# EasyEDA Pro project 磁回弹自动pcb电键_2024-09-19.epro

# Schematic 简易磁回弹自动电键
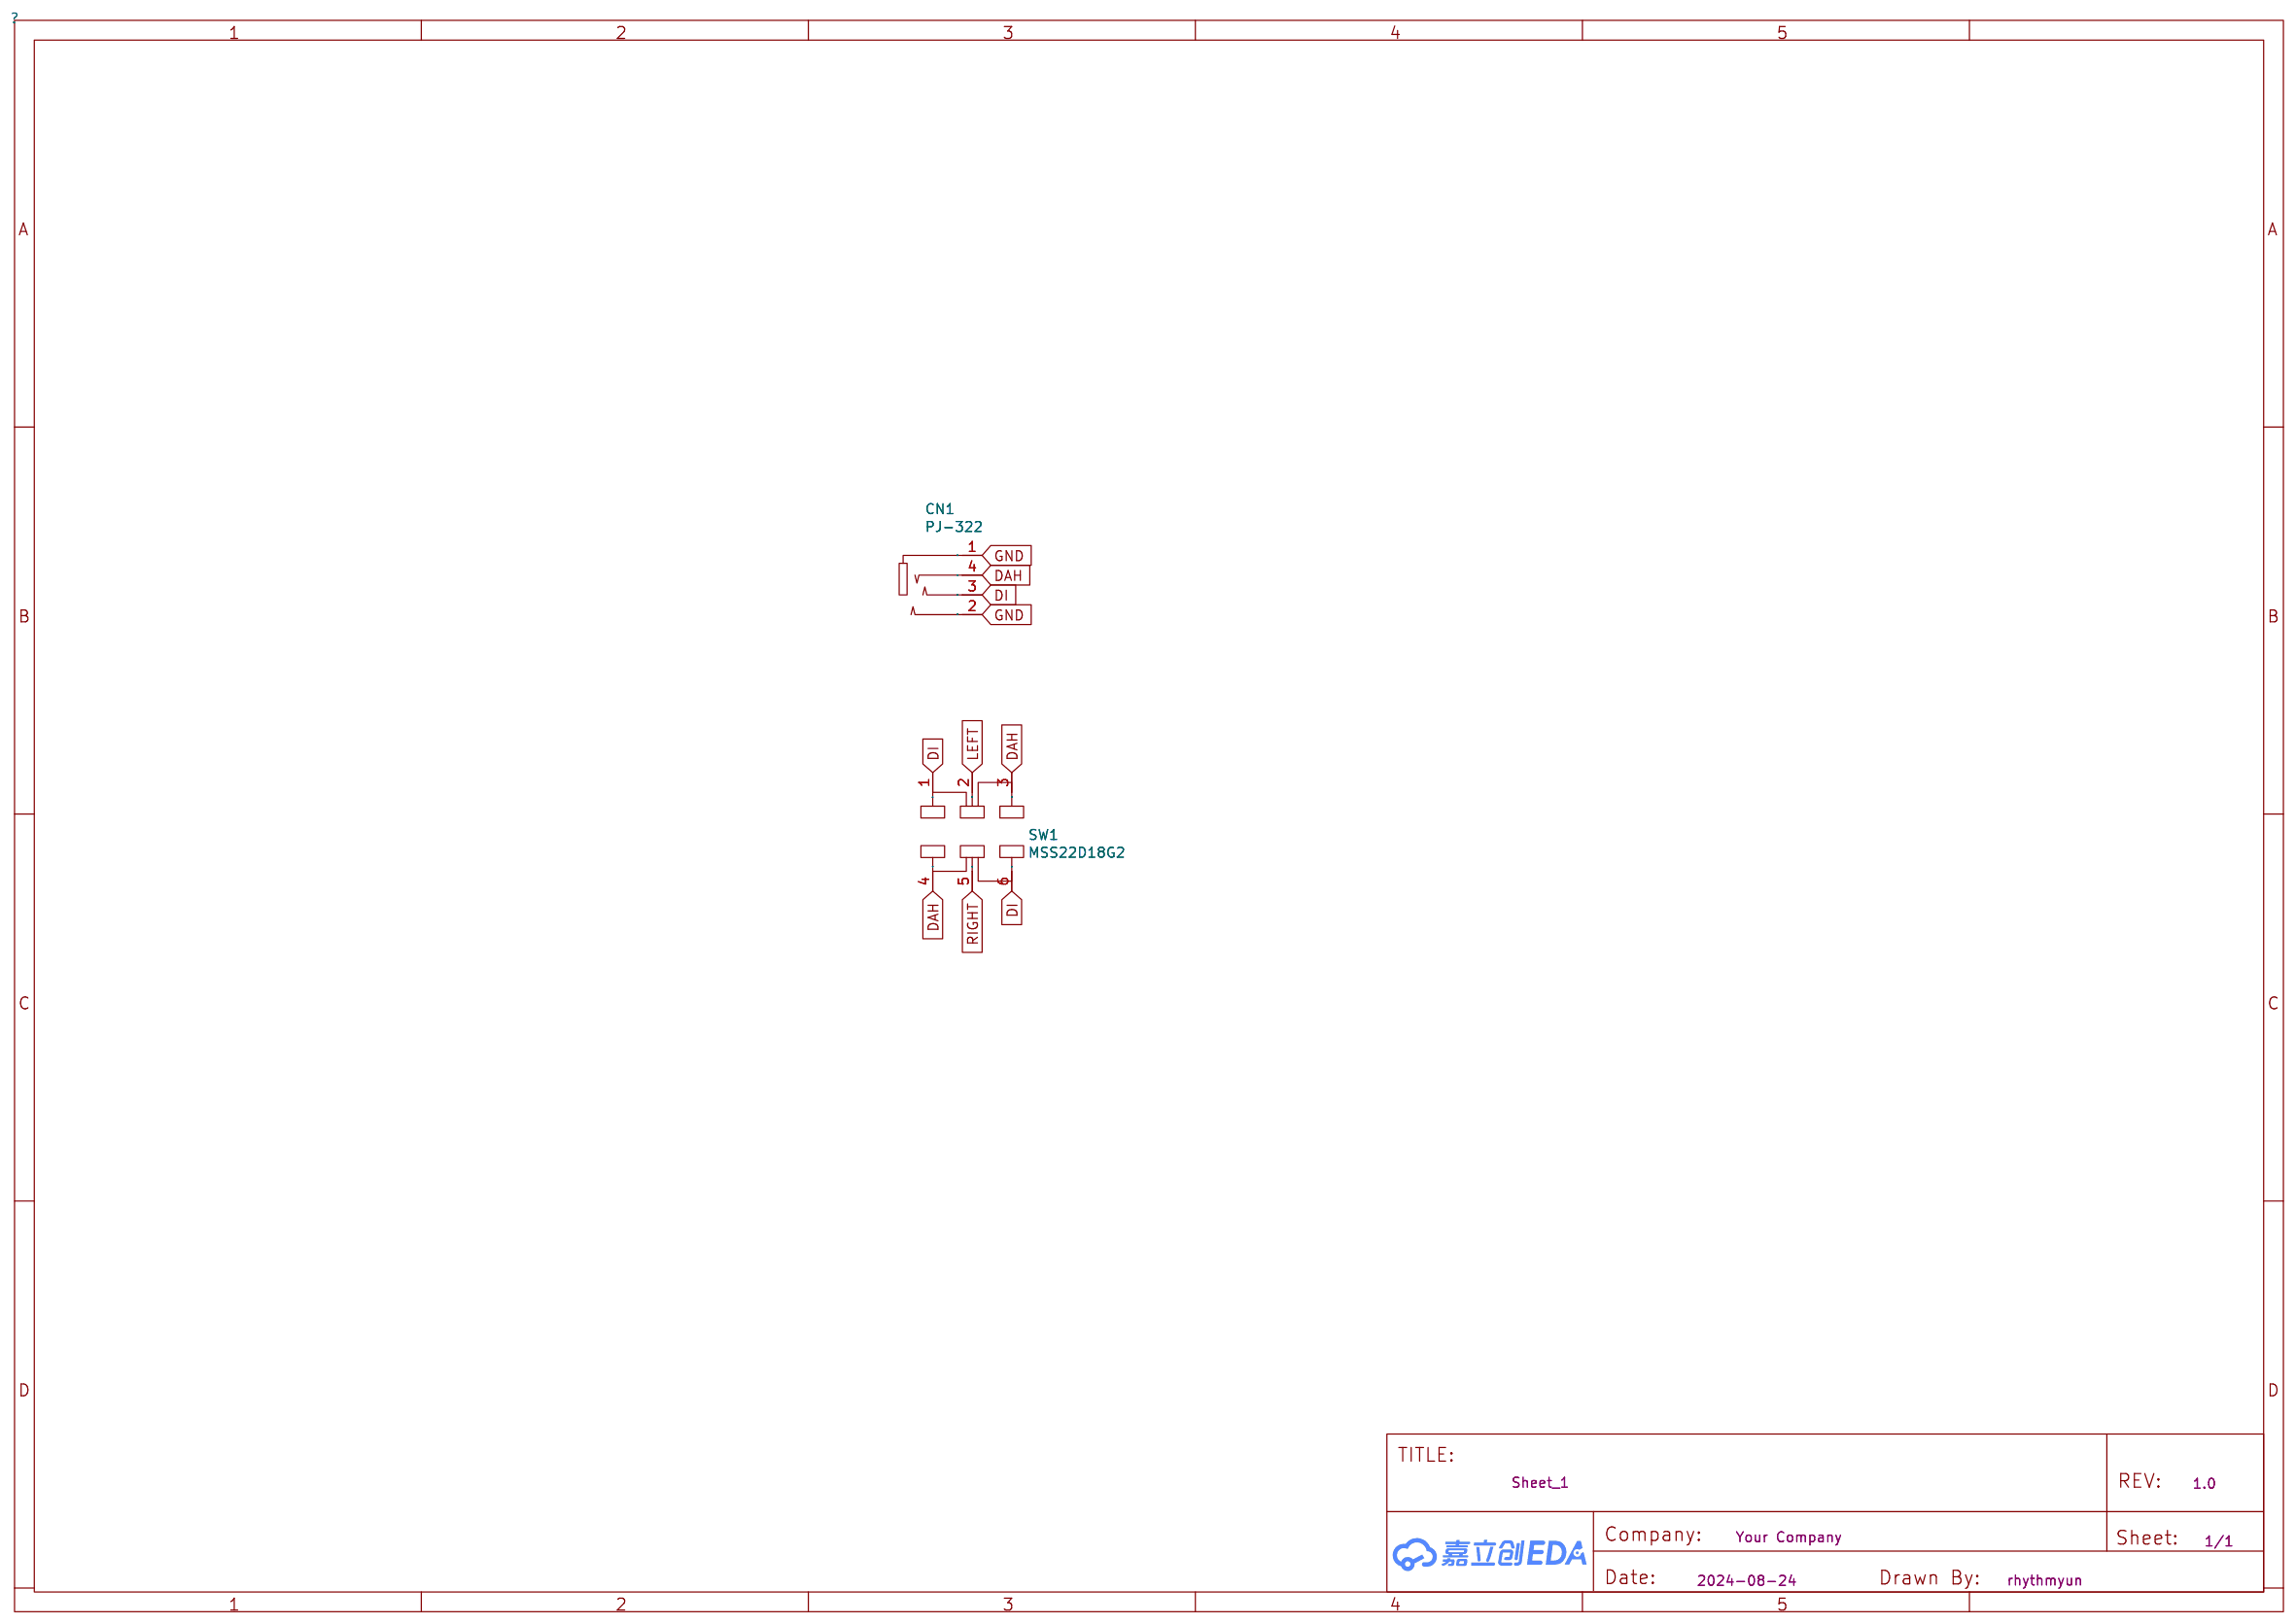
[diagram p0: schematic sheet]

## Parts
CN1  PJ-322  [AUDIO-TH_HOOYA_PJ-322]
SW1  MSS22D18G2  [SW-TH_MSS22D18GX]

## Library data of the parts
CN1 = PJ-322: Supplier: LCSC; Supplier Part: C2939185; Manufacturer: HOOYA(皓宇电子); Manufacturer Part: PJ-322环保; JLCPCB Part Class: Extended Part
SW1 = MSS22D18G2: Supplier: LCSC; Supplier Part: C431542; Manufacturer: SHOU HAN(首韩); JLCPCB Part Class: Extended Part

## Nets
GND: CN1.1 CN1.2
DAH: CN1.4 SW1.3 SW1.4
DI: CN1.3 SW1.1 SW1.6
LEFT: SW1.2
RIGHT: SW1.5

# Board 主面板
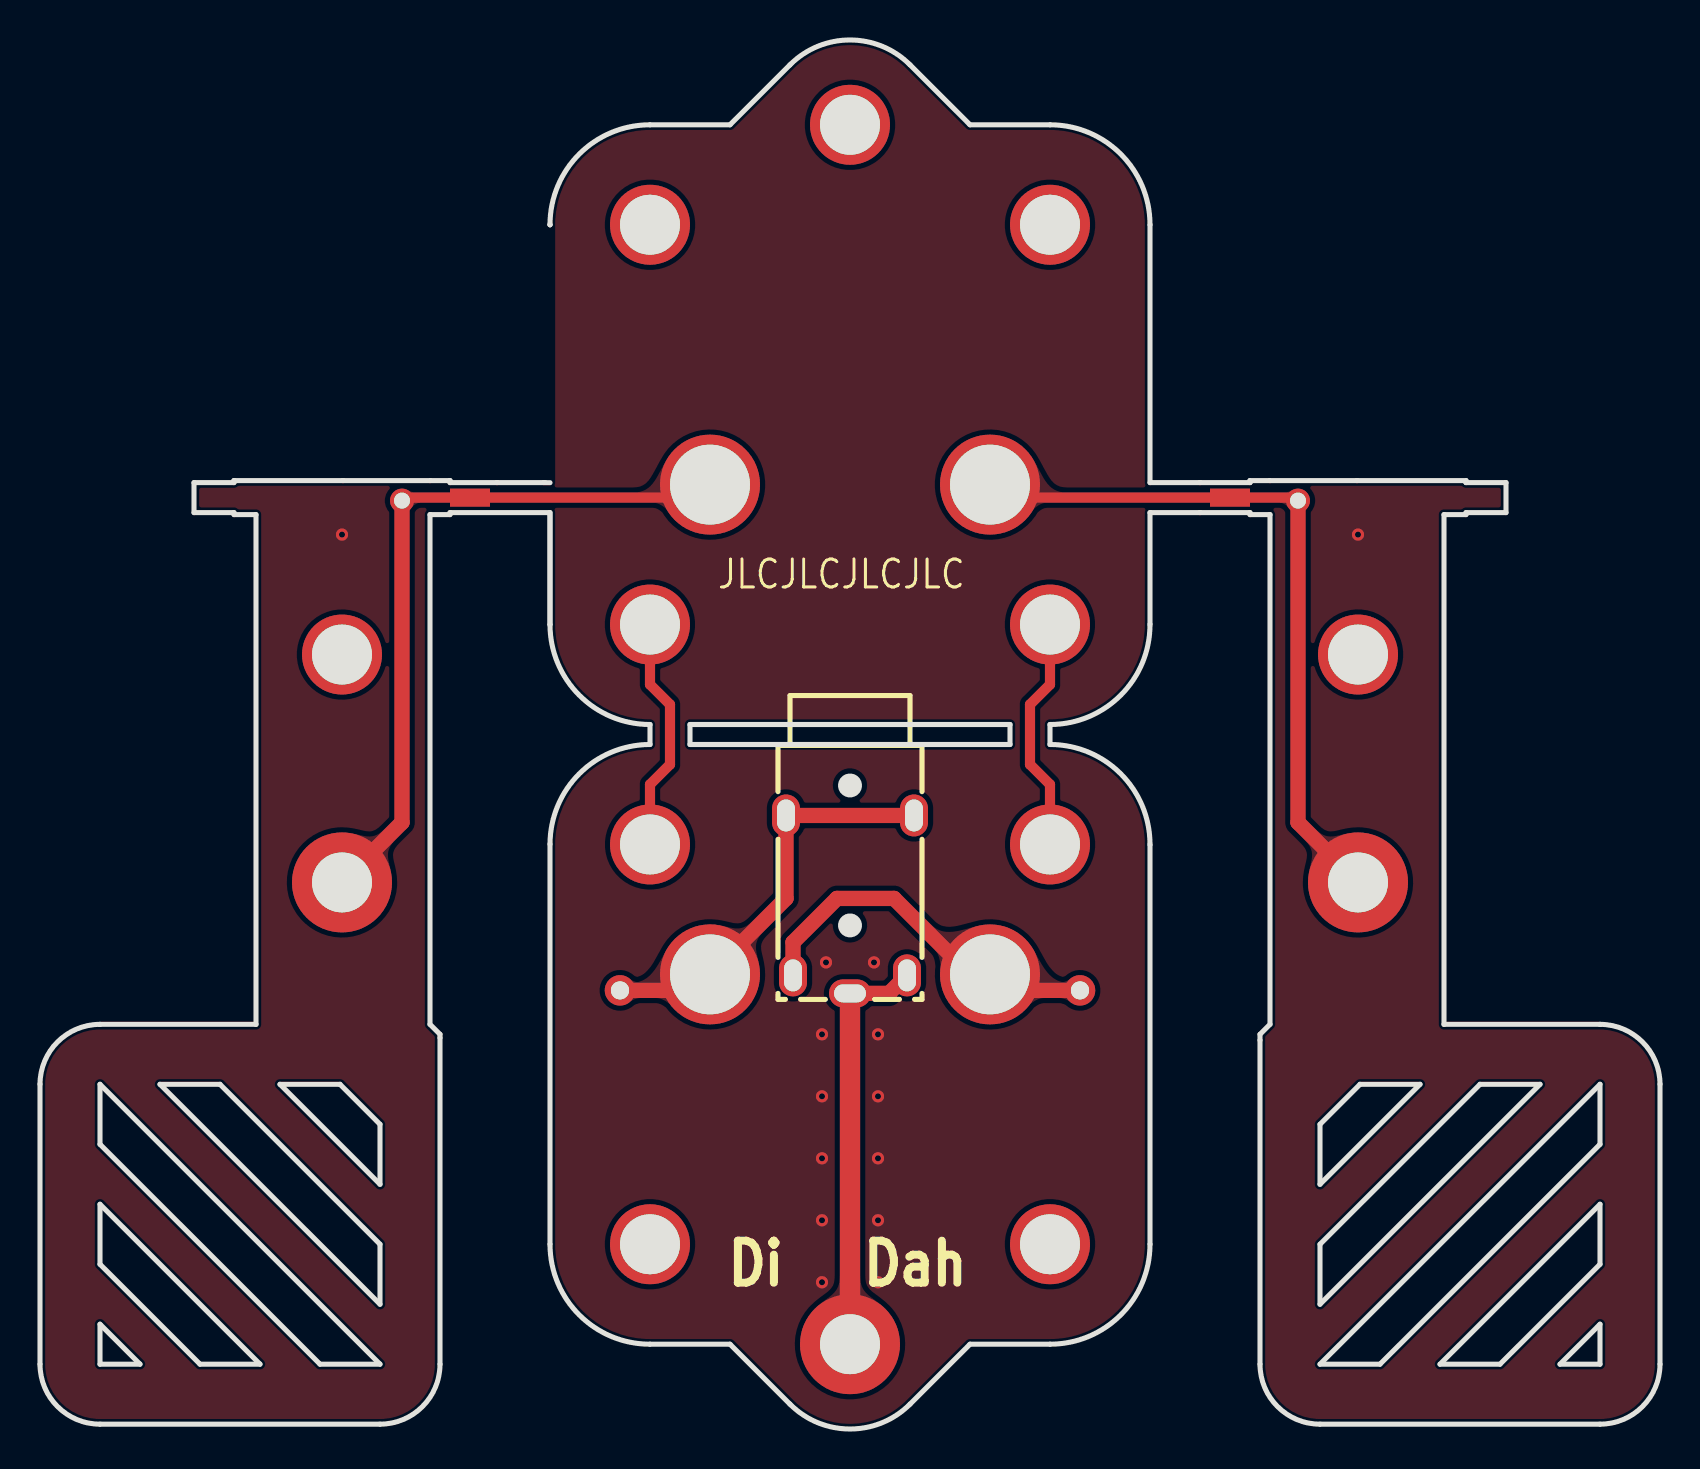
[diagram p1: board, top side]
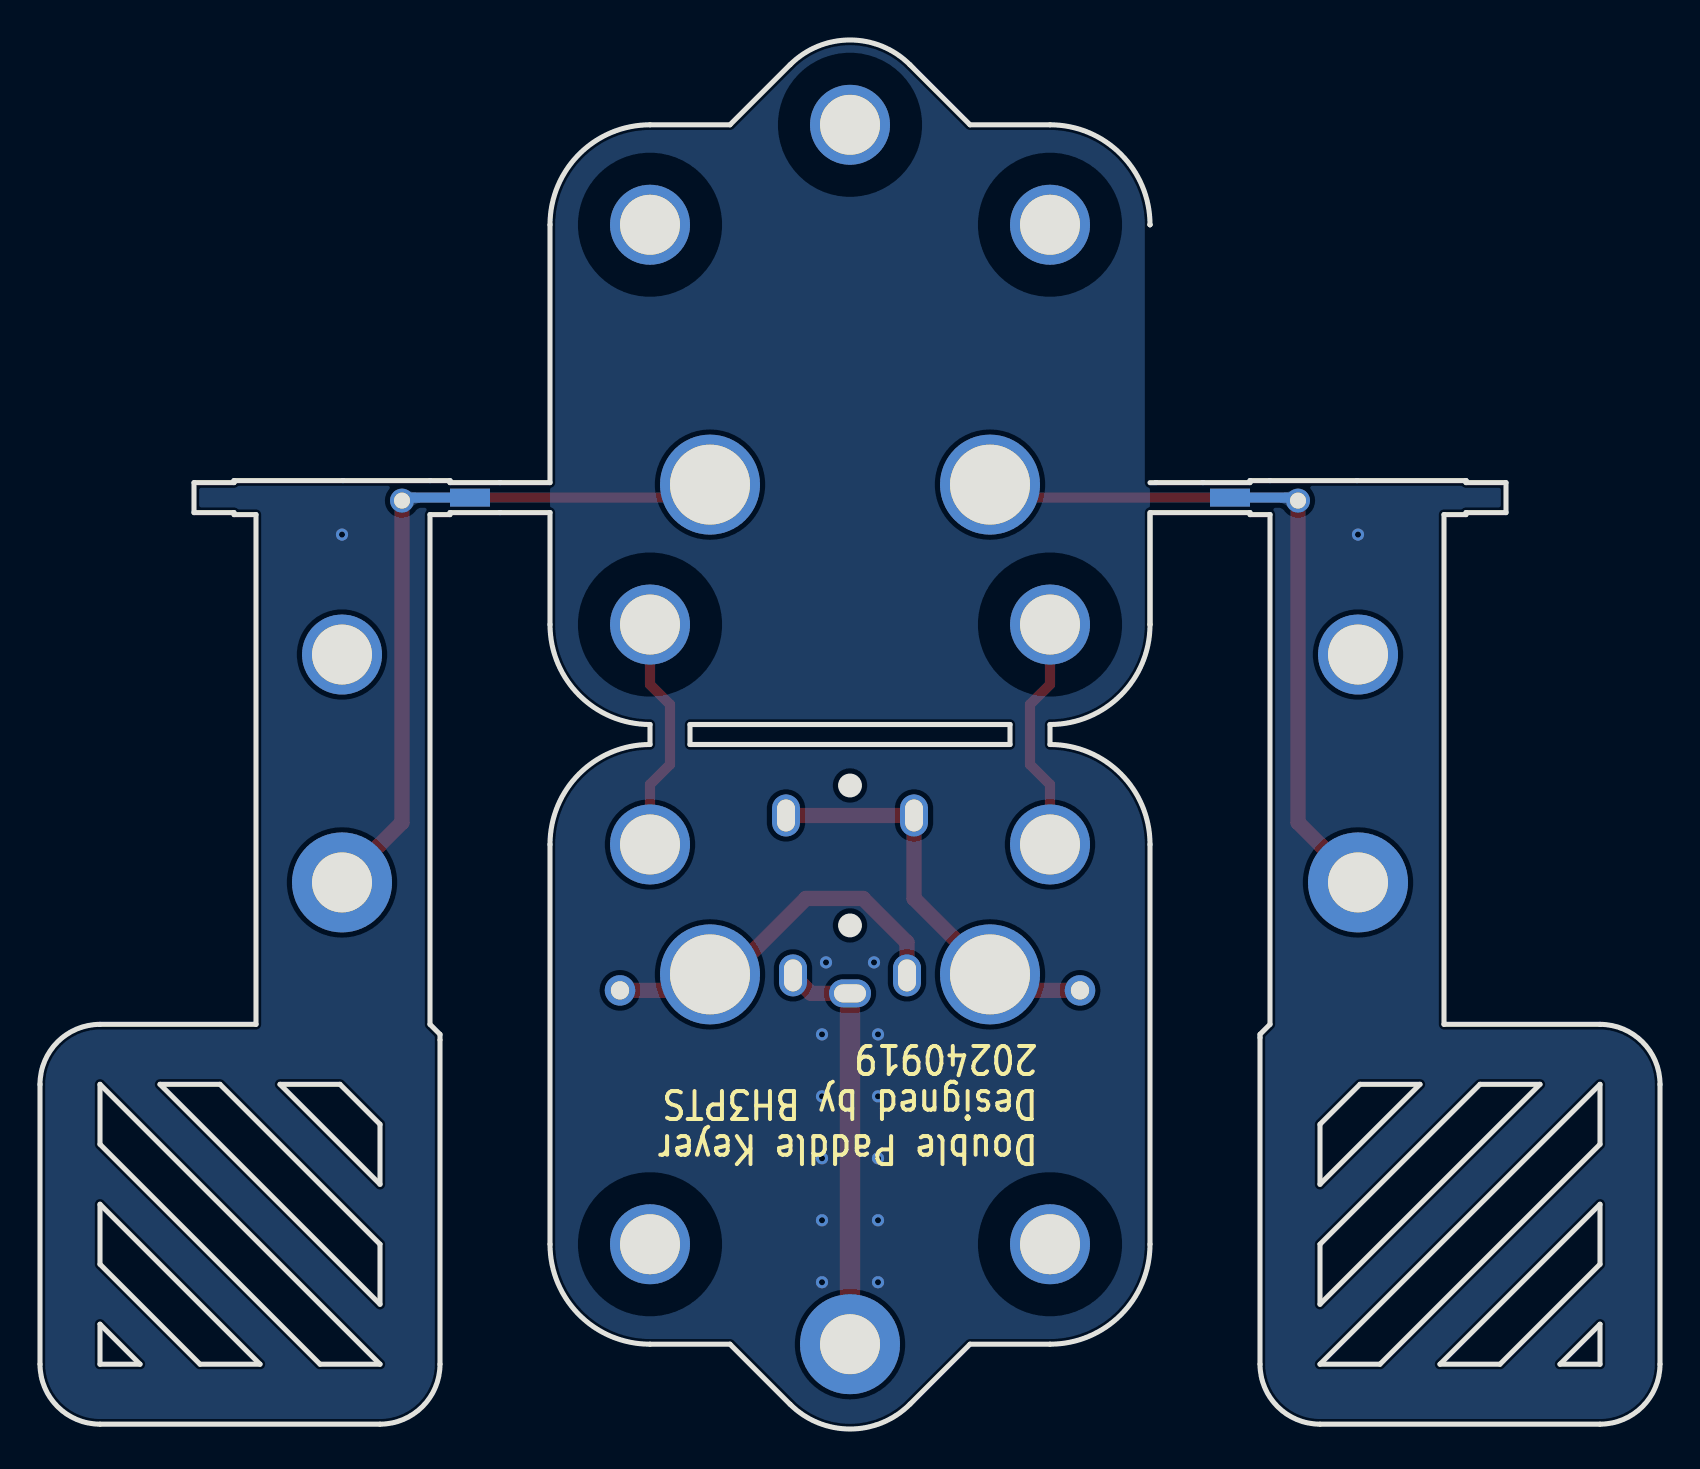
[diagram p2: board, bottom side, seen from below]

Outline 81 x 69.49 mm; copper layers: Top Layer, Bottom Layer. Coordinates in mm from the lower left corner of the outline.
Outline path: 25.5,45.84 20.5,45.84 20.5,45.74 19.5,45.74 19.5,20.24 20,19.74 20,3.24 arc(19.12,1.12) 17,0.24 3,0.24 arc(0.88,1.12) 0,3.24 0,17.24 arc(0.88,19.36) 3,20.24 10.8,20.24 10.8,45.74 9.7,45.74 9.7,45.84 7.7,45.84 7.7,47.34 9.7,47.34 9.7,47.44 9.7,47.44 20.5,47.44 20.5,47.44 20.5,47.34 25.2,47.34 25.5,47.34 ; 25.5,60.24 25.5,60.24 25.5,60.24 ; 25.5,60.24 arc(26.96,63.78) 30.5,65.24 34.5,65.24 37.5,68.24 arc(40.5,69.49) 43.5,68.24 46.5,65.24 50.5,65.24 arc(54.04,63.78) 55.5,60.24 55.5,47.34 60.5,47.34 60.5,47.35 60.5,47.44 71.3,47.44 71.3,47.35 71.3,47.34 73.3,47.34 73.3,45.84 71.3,45.84 71.3,45.74 70.2,45.74 70.2,20.24 78,20.24 arc(80.12,19.36) 81,17.24 81,3.24 arc(80.12,1.12) 78,0.24 64,0.24 arc(61.88,1.12) 61,3.24 61,19.74 61.5,20.24 61.5,45.74 60.5,45.74 60.5,45.84 55.5,45.84 55.5,40.25 arc(54.04,36.71) 50.5,35.24 50.5,34.24 arc(54.04,32.78) 55.5,29.24 55.5,9.24 arc(54.04,5.71) 50.5,4.24 46.5,4.24 43.5,1.24 arc(40.5,0) 37.5,1.24 34.5,4.24 30.5,4.24 arc(26.96,5.71) 25.5,9.24 25.5,29.24 arc(26.96,32.78) 30.5,34.24 30.5,35.24 arc(26.96,36.71) 25.5,40.24 ; 25.5,40.24 25.5,45.84 ; 25.5,40.24 25.5,45.74 ; 3,17.24 3,14.24 14,3.24 17,3.24 3,17.24 ; 3,11.24 3,8.24 8,3.24 11,3.24 3,11.24 ; 3,5.24 3,3.24 5,3.24 3,5.24 ; 6,17.24 9,17.24 17,9.24 17,6.24 6,17.24 ; 12,17.24 15,17.24 17,15.24 17,12.24 12,17.24 ; 32.5,35.24 48.5,35.24 48.5,34.24 32.5,34.24 32.5,35.24 ; 64,15.24 64,12.24 69,17.24 66,17.24 64,15.24 ; 64,9.24 64,6.24 75,17.24 72,17.24 64,9.24 ; 64,3.24 78,17.24 78,14.24 67,3.24 64,3.24 ; 70,3.24 78,11.24 78,8.24 73,3.24 70,3.24 ; 76,3.24 78,5.24 78,3.24 76,3.24
Stack: Top Layer 0.035mm / Dielectric1 1.51mm FR4 er 4.5 / Bottom Layer 0.035mm

## Design rules (mm)
template: JLCPCB Capability(Two Layers Board)
spacing copperThickness1oz (default): track to track 0.102, other pairs 0.152 to 0.3
spacing copperThickness2oz: track to track 0.203, other pairs 0.152 to 0.3
track width copperThickness1oz (default): min 0.127, default 0.254, max 2.54
track width copperThickness2oz: min 0.203, default 0.254, max 2.54
differential pair differentialPair (default): width min 0.127, default 0.254, max 2.54; gap min 0.152, default 0.152
via viaSize (default): diameter min 0.5, default 0.61, max 10; hole min 0.3, default 0.305, max 6.3

## Placement (name value [footprint] x y rotation side)
CN1  PJ-322  [AUDIO-TH_HOOYA_PJ-322]  40.5 26.24 270 top
NOREF  -  [Pad_e187]  65.9 27.34 0 top
NOREF#2  -  [Pad_e76]  62.9 46.44 180 top
NOREF#3  -  [Pad_e37]  30.5 9.24 0 top
NOREF#4  -  [Pad_e80]  33.5 47.24 180 top
NOREF#5  -  [Pad_e35]  50.5 29.24 0 top
NOREF#6  -  [Pad_e39]  33.5 22.74 0 top
NOREF#7  -  [Pad_e81]  47.5 47.24 180 top
NOREF#8  -  [Pad_e72]  59.5 46.59 0 top
NOREF#9  -  [Pad_e40]  47.5 22.74 0 top
NOREF#10  -  [Pad_e85]  30.5 40.24 180 top
NOREF#11  -  [Pad_e305]  21.5 46.59 180 top
NOREF#12  -  [Pad_e797]  52 21.94 180 top
NOREF#13  -  [Pad_e75]  59.5 46.59 0 top
NOREF#14  -  [Pad_e186]  65.9 38.74 0 top
NOREF#15  -  [Pad_e82]  50.5 60.24 180 top
NOREF#16  -  [Pad_e304]  21.5 46.59 180 top
NOREF#17  -  [Pad_e33]  30.5 29.24 0 top
NOREF#18  -  [Pad_e302]  18.1 46.44 0 top
NOREF#19  -  [Pad_e301]  15.1 27.34 180 top
NOREF#20  -  [Pad_e303]  15.1 38.74 180 top
NOREF#21  -  [Pad_e83]  40.5 65.24 180 top
NOREF#22  -  [Pad_e36]  50.5 9.24 0 top
NOREF#23  -  [Pad_e84]  50.5 40.24 180 top
NOREF#24  -  [Pad_e796]  29 21.94 0 top
NOREF#25  -  [Pad_e38]  40.5 4.24 0 top
NOREF#26  -  [Pad_e79]  30.5 60.24 180 top

## Footprints (pads in the part's own frame, mm; a bottom-side part is the same pattern mirrored in y, then rotated)
AUDIO-TH_HOOYA_PJ-322
  oval 1.4x2.1 hole 0.9x1.6: 1(4.45,0)
  oval 2.1x1.4 hole 1.6x0.9: 2(3.55,2.85) 3(-4.45,3.2) 3(-4.45,-3.2) 4(3.55,-2.85)
Pad_e33
  round 4 hole 3: (0,0)
Pad_e35
  round 4 hole 3: (0,0)
Pad_e36
  round 4 hole 3: (0,0)
Pad_e37
  round 4 hole 3: (0,0)
Pad_e38
  round 5 hole 3: (0,0)
Pad_e39
  round 5 hole 4: (0,0)
Pad_e40
  round 5 hole 4: (0,0)
Pad_e72
  custom 0x0 smd: 1(0,0)
Pad_e75
  custom 0x0 smd far side: 1(0,0)
Pad_e76
  round 1.2 hole 0.8: 1(0,0)
Pad_e79
  round 4 hole 3: (0,0)
Pad_e80
  round 5 hole 4: 1(0,0)
Pad_e81
  round 5 hole 4: 2(0,0)
Pad_e82
  round 4 hole 3: (0,0)
Pad_e83
  round 4 hole 3: (0,0)
Pad_e84
  round 4 hole 3: (0,0)
Pad_e85
  round 4 hole 3: (0,0)
Pad_e186
  round 4 hole 3: (0,0)
Pad_e187
  round 5 hole 3: (0,0)
Pad_e301
  round 5 hole 3: (0,0)
Pad_e302
  round 1.2 hole 0.8: 1(0,0)
Pad_e303
  round 4 hole 3: (0,0)
Pad_e304
  custom 0x0 smd: 1(0,0)
Pad_e305
  custom 0x0 smd far side: 1(0,0)
Pad_e796
  round 1.524 hole 0.914: 1(0,0)
Pad_e797
  round 1.524 hole 0.914: 1(0,0)

## Nets
DGND: CN1.1 CN1.2 NOREF#21. NOREF#25.
DAH: CN1.4 NOREF. NOREF#2.1 NOREF#7.2 NOREF#8.1 NOREF#9. NOREF#12.1 NOREF#13.1
DI: CN1.3 NOREF#4.1 NOREF#6. NOREF#11.1 NOREF#16.1 NOREF#18.1 NOREF#19. NOREF#24.1

## Via types
v1: diameter 0.61, hole 0.305, Top Layer to Bottom Layer, 14 vias

## Routing (per net, layer and track width the routed paths; a pad name or vN(x,y) marks a point on that pad's centre or on a via; arc(x,y) is an arc through that point)
DGND: length 20.8
  Top Layer w0.762: CN1.2 42.45,21.79 CN1.1
  Top Layer w1.016: 40.5,4.24 CN1.1
GND:
  vias: v1(15.1,44.74) v1(39.1,19.74) v1(39.1,16.64) v1(39.1,13.54) v1(39.1,10.44) v1(39.1,7.34) v1(39.3,23.34) v1(41.7,23.34) v1(41.9,19.74) v1(41.9,16.64) v1(41.9,13.54) v1(41.9,10.44) v1(41.9,7.34) v1(65.9,44.74)
(no net): length 23.7
  Top Layer w0.508: 30.5,29.24 30.5,32.24 31.5,33.24 31.5,36.24 30.5,37.24 30.5,40.24 ; 50.5,29.24 50.5,32.24 49.5,33.24 49.5,36.24 50.5,37.24 50.5,40.24
DAH: length 59.1
  Top Layer w0.508: NOREF#7.2 48.15,46.59 62.75,46.59 NOREF#2.1
  Top Layer w0.762: CN1.4 37.65,24.34 39.85,26.54 42.7,26.54 46.5,22.74 47.5,22.74 48.3,21.94 NOREF#12.1 ; NOREF#2.1 62.9,30.34 65.9,27.34
  Bottom Layer w0.508: NOREF#2.1 62.75,46.59 58.8,46.59
DI: length 61
  Top Layer w0.508: NOREF#18.1 18.25,46.59 NOREF#11.1 32.85,46.59 NOREF#4.1
  Top Layer w0.762: NOREF#18.1 18.1,30.34 15.1,27.34 ; CN1.3 CN1.3 37.3,26.54 32.7,21.94 NOREF#24.1
  Bottom Layer w0.508: 22.2,46.59 18.25,46.59 NOREF#18.1

## Copper pours and planes (outline as drawn; the poured copper is in the pictures)
GND on Top Layer: -4.46,73.63 84.44,73.63 84.44,-5.97 -4.46,-5.97
GND on Bottom Layer: -5.18,71.92 83.72,71.92 83.72,-7.68 -5.18,-7.68

Small or netless copper shapes (teardrops, artwork), in the pictures only: 15 on Top Layer, 2 on Bottom Layer

## Text on the board
Bottom Silkscreen Layer: Double Paddle Keyer / Designed by BH3PTS / 20240919
Top Silkscreen Layer: JLCJLCJLCJLC | Di   Dah
